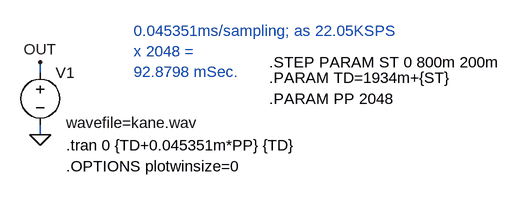
[diagram p0: schematic Fig_9-24_KANE_A-.asc]
Fig_9-24_KANE_A-.asc, the LTspice schematic file:
Version 4
SHEET 1 940 680
WIRE 144 144 144 128
WIRE 144 240 144 224
FLAG 144 240 0
FLAG 144 128 OUT
SYMBOL voltage 144 128 R0
WINDOW 3 40 93 Left 2
SYMATTR Value wavefile=kane.wav
SYMATTR InstName V1
TEXT 184 256 Left 2 !.tran 0 {TD+0.045351m*PP} {TD}
TEXT 288 80 Left 2 ;0.045351ms/sampling; as 22.05KSPS\nx 2048 =\n92.8798 mSec.
TEXT 184 288 Left 2 !.OPTIONS plotwinsize=0
TEXT 496 152 Left 2 !.PARAM TD=1934m+{ST}
TEXT 496 184 Left 2 !.PARAM PP 2048
TEXT 496 128 Left 2 !.STEP PARAM ST 0 800m 200m

The netlist it stands for:
* Fig_9-24_KANE_A-.asc
V1 OUT 0 wavefile=kane.wav
.tran 0 {TD+0.045351m*PP} {TD}
* 0.045351ms/sampling; as 22.05KSPS
* x 2048 =
* 92.8798 mSec.
.OPTIONS plotwinsize=0
.PARAM TD=1934m+{ST}
.PARAM PP 2048
.STEP PARAM ST 0 800m 200m
.backanno
.end